# Altium schematic sheet Sheet1.SchDoc
size A4; SheetNumber: 1; SheetTotal: 1
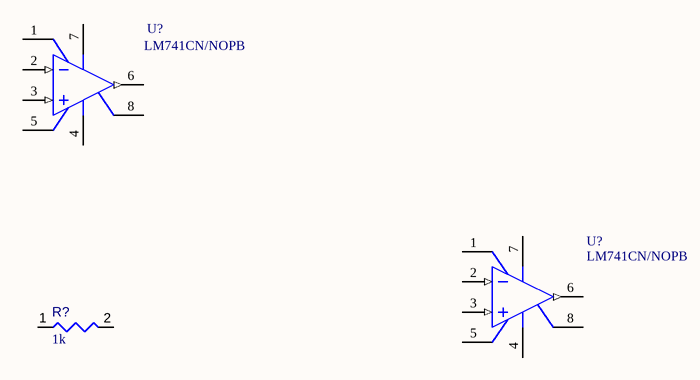
[diagram p0: Sheet1.SchDoc]

## Parts
(Parts that share a designator on the sheet are numbered #1, #2 ... from top to bottom, then left to right.)
R?  value 1k  [RESA60-630X240]  (hidden comment: MFR-25FBF52-1K)
U?#1  LM741CN/NOPB  [P0008A]
U?#2  LM741CN/NOPB  [P0008A]

## Nets

Not connected (* = marked no-connect by the designer): R? 1 2; U?#1 1(OFS_NULL) 2(IN-) 3(IN+) 4(V-) 5(OFS_NULL) 6(OUT) 7(V+) 8(NC); U?#2 1(OFS_NULL) 2(IN-) 3(IN+) 4(V-) 5(OFS_NULL) 6(OUT) 7(V+) 8(NC)

## Library data of the parts
R? = CMP-009-00048-4: Axial Resistor, 1 KOhm, +/- 1%, 250 mW, -55 to 155 degC, 2-Pin THD, RoHS, Bulk; Manufacturer: Yageo; Voltage Rating: 250V; Power: 250mW; Min Operating Temperature: -55°C; Max Operating Temperature: 155°C; Tolerance: 1%; Package Reference: MFR-25; Composition: CarbonFilm; Mounting Technology: TH; Packaging: Bulk; Case/Package: Axial; Datasheet URL: http://www.yageo.com/documents/recent/Yageo%20LR_MFR_2013.pdf; Package Quantity: 200; Manufacturer URL: http://www.yageo.com/; Package Description: 2-Pin Axial Lead, Dia 2.4 mm, Body Length 6.3 mm; Datasheet Version: Apr-13; RoHS Compliant: True
U?#1 U?#2 = CMP-0055-00162-3: Operational Amplifier, 8-pin MDIP, Pb-Free; Manufacturer: Texas Instruments; PackageTopMarking: NSUZXYTTE#*LM*741CN; PowerWise: N; CompType: Amplifiers; ComponentLink1Description: Datasheet URL; ComponentLink1URL: http://www.ti.com/general/docs/lit/getliterature.tsp?genericPartNumber=LM741&fileType=pdf; PackageDescription: MDIP, .365 x .250 x .130in, 8 Lead, .100in Pitch; RoHS: Y; PinCount: 8; Code_JEDEC: MS-001-BA; Package Reference: P0008A